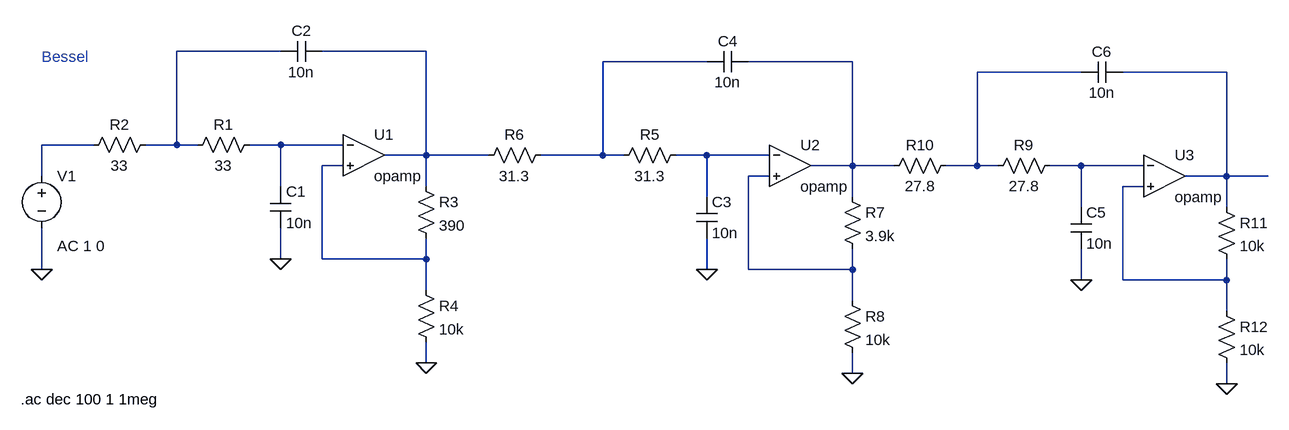
[diagram p0: schematic Filtro DAC PyD.asc]
Filtro DAC PyD.asc, the LTspice schematic file:
Version 4.1
SHEET 1 1768 1144
WIRE -224 -288 -384 -288
WIRE 0 -288 -160 -288
WIRE 432 -272 272 -272
WIRE 656 -272 496 -272
WIRE 1008 -256 848 -256
WIRE 1232 -256 1072 -256
WIRE -512 -144 -592 -144
WIRE -384 -144 -384 -288
WIRE -384 -144 -432 -144
WIRE -352 -144 -384 -144
WIRE -224 -144 -272 -144
WIRE -128 -144 -224 -144
WIRE 0 -128 0 -288
WIRE 0 -128 -64 -128
WIRE 96 -128 0 -128
WIRE 272 -128 272 -272
WIRE 272 -128 176 -128
WIRE 304 -128 272 -128
WIRE 432 -128 384 -128
WIRE 528 -128 432 -128
WIRE -128 -112 -160 -112
WIRE 656 -112 656 -272
WIRE 656 -112 592 -112
WIRE 720 -112 656 -112
WIRE 848 -112 848 -256
WIRE 848 -112 800 -112
WIRE 880 -112 848 -112
WIRE 1008 -112 960 -112
WIRE 1104 -112 1008 -112
WIRE -592 -96 -592 -144
WIRE 528 -96 496 -96
WIRE 1232 -96 1232 -256
WIRE 1232 -96 1168 -96
WIRE 1296 -96 1232 -96
WIRE -224 -80 -224 -144
WIRE 0 -80 0 -128
WIRE 1104 -80 1072 -80
WIRE 432 -64 432 -128
WIRE 656 -64 656 -112
WIRE 1008 -48 1008 -112
WIRE 1232 -48 1232 -96
WIRE -224 32 -224 -16
WIRE -160 32 -160 -112
WIRE 0 32 0 0
WIRE 0 32 -160 32
WIRE -592 48 -592 -16
WIRE 432 48 432 0
WIRE 496 48 496 -96
WIRE 656 48 656 16
WIRE 656 48 496 48
WIRE 1008 64 1008 16
WIRE 1072 64 1072 -80
WIRE 1232 64 1232 32
WIRE 1232 64 1072 64
WIRE 0 80 0 32
WIRE 656 96 656 48
WIRE 1232 112 1232 64
WIRE 0 192 0 160
WIRE 656 208 656 176
WIRE 1232 224 1232 192
FLAG -224 32 0
FLAG -592 48 0
FLAG 0 192 0
FLAG 432 48 0
FLAG 656 208 0
FLAG 1008 64 0
FLAG 1232 224 0
SYMBOL sym\\opamp -96 -192 R0
SYMATTR InstName U1
SYMBOL res -256 -160 R90
WINDOW 0 0 56 VBottom 2
WINDOW 3 32 56 VTop 2
SYMATTR InstName R1
SYMATTR Value 33
SYMBOL res -416 -160 R90
WINDOW 0 0 56 VBottom 2
WINDOW 3 32 56 VTop 2
SYMATTR InstName R2
SYMATTR Value 33
SYMBOL res -16 -96 R0
SYMATTR InstName R3
SYMATTR Value 390
SYMBOL res -16 64 R0
SYMATTR InstName R4
SYMATTR Value 10k
SYMBOL cap -240 -80 R0
SYMATTR InstName C1
SYMATTR Value 10n
SYMBOL cap -160 -304 R90
WINDOW 0 0 32 VBottom 2
WINDOW 3 32 32 VTop 2
SYMATTR InstName C2
SYMATTR Value 10n
SYMBOL voltage -592 -112 R0
WINDOW 123 24 124 Left 2
WINDOW 39 0 0 Left 0
SYMATTR Value2 AC 1 0
SYMATTR InstName V1
SYMATTR Value ""
SYMBOL sym\\opamp 560 -176 R0
SYMATTR InstName U2
SYMBOL res 400 -144 R90
WINDOW 0 0 56 VBottom 2
WINDOW 3 32 56 VTop 2
SYMATTR InstName R5
SYMATTR Value 31.3
SYMBOL res 192 -144 R90
WINDOW 0 0 56 VBottom 2
WINDOW 3 32 56 VTop 2
SYMATTR InstName R6
SYMATTR Value 31.3
SYMBOL res 640 -80 R0
SYMATTR InstName R7
SYMATTR Value 3.9k
SYMBOL res 640 80 R0
SYMATTR InstName R8
SYMATTR Value 10k
SYMBOL cap 416 -64 R0
SYMATTR InstName C3
SYMATTR Value 10n
SYMBOL cap 496 -288 R90
WINDOW 0 0 32 VBottom 2
WINDOW 3 32 32 VTop 2
SYMATTR InstName C4
SYMATTR Value 10n
SYMBOL sym\\opamp 1136 -160 R0
SYMATTR InstName U3
SYMBOL res 976 -128 R90
WINDOW 0 0 56 VBottom 2
WINDOW 3 32 56 VTop 2
SYMATTR InstName R9
SYMATTR Value 27.8
SYMBOL res 816 -128 R90
WINDOW 0 0 56 VBottom 2
WINDOW 3 32 56 VTop 2
SYMATTR InstName R10
SYMATTR Value 27.8
SYMBOL res 1216 -64 R0
SYMATTR InstName R11
SYMATTR Value 10k
SYMBOL res 1216 96 R0
SYMATTR InstName R12
SYMATTR Value 10k
SYMBOL cap 992 -48 R0
SYMATTR InstName C5
SYMATTR Value 10n
SYMBOL cap 1072 -272 R90
WINDOW 0 0 32 VBottom 2
WINDOW 3 32 32 VTop 2
SYMATTR InstName C6
SYMATTR Value 10n
TEXT -592 -280 Left 2 ;Bessel
TEXT -624 248 Left 2 !.ac dec 100 1 1meg

The netlist it stands for:
* Filtro DAC PyD.asc
X§U1 N008 N010 N002 opamp Aol=100K GBW=10Meg  ; pins invin noninvin out
R1 N008 N001 33
R2 N001 N007 33
R3 N002 N010 390
R4 N010 0 10k
C1 N008 0 10n
C2 N002 N001 10n
V1 N007 0 AC 1 0
X§U2 N009 N012 N004 opamp Aol=100K GBW=10Meg  ; pins invin noninvin out
R5 N009 N003 31.3
R6 N003 N002 31.3
R7 N004 N012 3.9k
R8 N012 0 10k
C3 N009 0 10n
C4 N004 N003 10n
X§U3 N011 N013 N006 opamp Aol=100K GBW=10Meg  ; pins invin noninvin out
R9 N011 N005 27.8
R10 N005 N004 27.8
R11 N006 N013 10k
R12 N013 0 10k
C5 N011 0 10n
C6 N006 N005 10n
* Bessel
.ac dec 100 1 1meg
.backanno
.end